# Altium schematic sheet LevelShifter.SchDoc: Misc
size Legal; Project: Olympus; Organization: Stanford SSI; Address1: L3, 12a Rodborough Rd; Address2: Frenchs Forest; Address3: NSW; Address4: Australia 2086; SheetNumber: n; SheetTotal: m
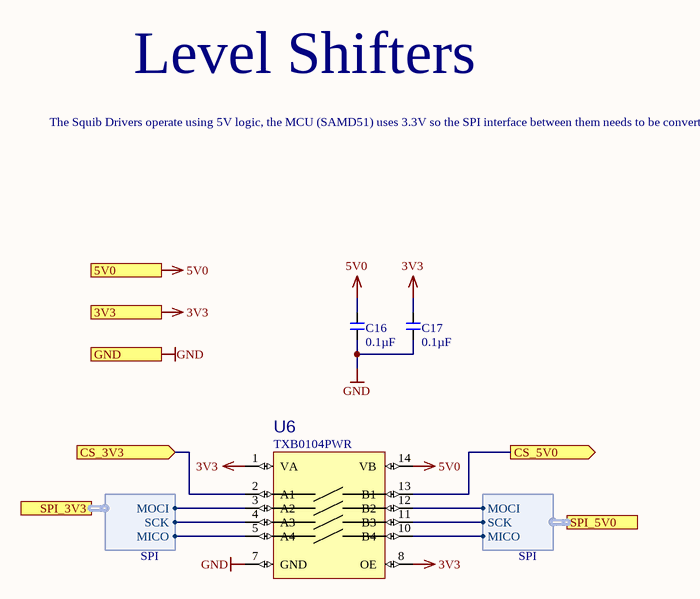
[diagram p0: LevelShifter.SchDoc]

## Parts
C16  Capacitance (shorthand): 0.1µF  [C0603]  (hidden comment: 490-1519-1-ND)
C17  Capacitance (shorthand): 0.1µF  [C0603]  (hidden comment: 490-1519-1-ND)
U6  Manufacturer Part Number: TXB0104PWR  [14TSSOP65]  (hidden comment: LVLSHFT_TXB0104PWR)

## Ports
3V3 (in), 5V0 (in), CS_3V3 (in), CS_5V0 (out), GND (in), SPI_3V3 (harness SPI), SPI_5V0 (harness SPI)

## Harnesses
SPI: MICO, MOCI, SCK

## Nets
3V3: C17.1 U6.1(VA) U6.8(OE) ; port 3V3
5V0: C16.1 U6.14(VB) ; port 5V0
GND: C16.2 C17.2 U6.7(GND) ; port GND
CS_3V3: U6.2(A1) ; port CS_3V3
CS_5V0: U6.13(B1) ; port CS_5V0
NetU6_3: U6.3(A2) ; port SPI_3V3.MOCI
NetU6_4: U6.4(A3) ; port SPI_3V3.SCK
NetU6_5: U6.5(A4) ; port SPI_3V3.MICO
NetU6_10: U6.10(B4) ; port SPI_5V0.MICO
NetU6_11: U6.11(B3) ; port SPI_5V0.SCK
NetU6_12: U6.12(B2) ; port SPI_5V0.MOCI

## Notes on the sheet
- Level Shifters
- The Squib Drivers operate using 5V logic, the MCU (SAMD51) uses 3.3V so the SPI interface between them needs to be converted
- PROJECT
- SHEET
- Powered By
- Sheet
- of
- REVISION
- ssi.stanford.edu
- ENGINEER
- REVIEWER
- REVIEWED ON

## Library data of the parts
C16 C17 = CMP-119-0065-1: CAP CER 0603 0.1µF X7R 50V 10%; Manufacturer: Murata Electronics North America; Capacitance - pF (Machine readable): #NAME?; Rated Voltage: 50V; Dielectric: X7R
U6 = CMP-045-0016-1: 4 Pin Bidirectional levelshifter 5v-3.3v; Manufacturer: Texas Instruments; Translator Type: Voltage Level; Number of Circuits: 1; Channels per Circuit: 4; Voltage - VCCA: 1.2 V ~ 3.6 V; Voltage - VCCB: 1.65 V ~ 5.5 V; Output Type: Tri-State, Non-Inverted; Data Rate: 100Mbps; Value: *; RoHS: RoHS Compliant; Stock 1: 16134; Pricing 1: 1=1.39, 10=1.246, 100=0.9717, 500=0.8036, 1000=0.6355 (USD); Packaging: Cut Tape (CT); Channel Type: Bidirectional; Input Signal: -; Output Signal: -; Operating Temperature: -40°C ~ 85°C (TA); Features: Auto-Direction Sensing; Mounting Type: Surface Mount; Package / Case: 14-TSSOP (0.173", 4.40mm Width); Supplier Device Package: 14-TSSOP; ComponentLink1URL: http://www.ti.com/lit/ds/symlink/txb0104.pdf; ComponentLink1Description: http://www.ti.com/lit/ds/symlink/txb0104.pdf; Source: ic_interface.SchLib; Design Item ID: LVLSHFT_TXB0104PWR